# EAGLE design 620000200  -  GK_A_1.0 (EAGLE 7.2.0)
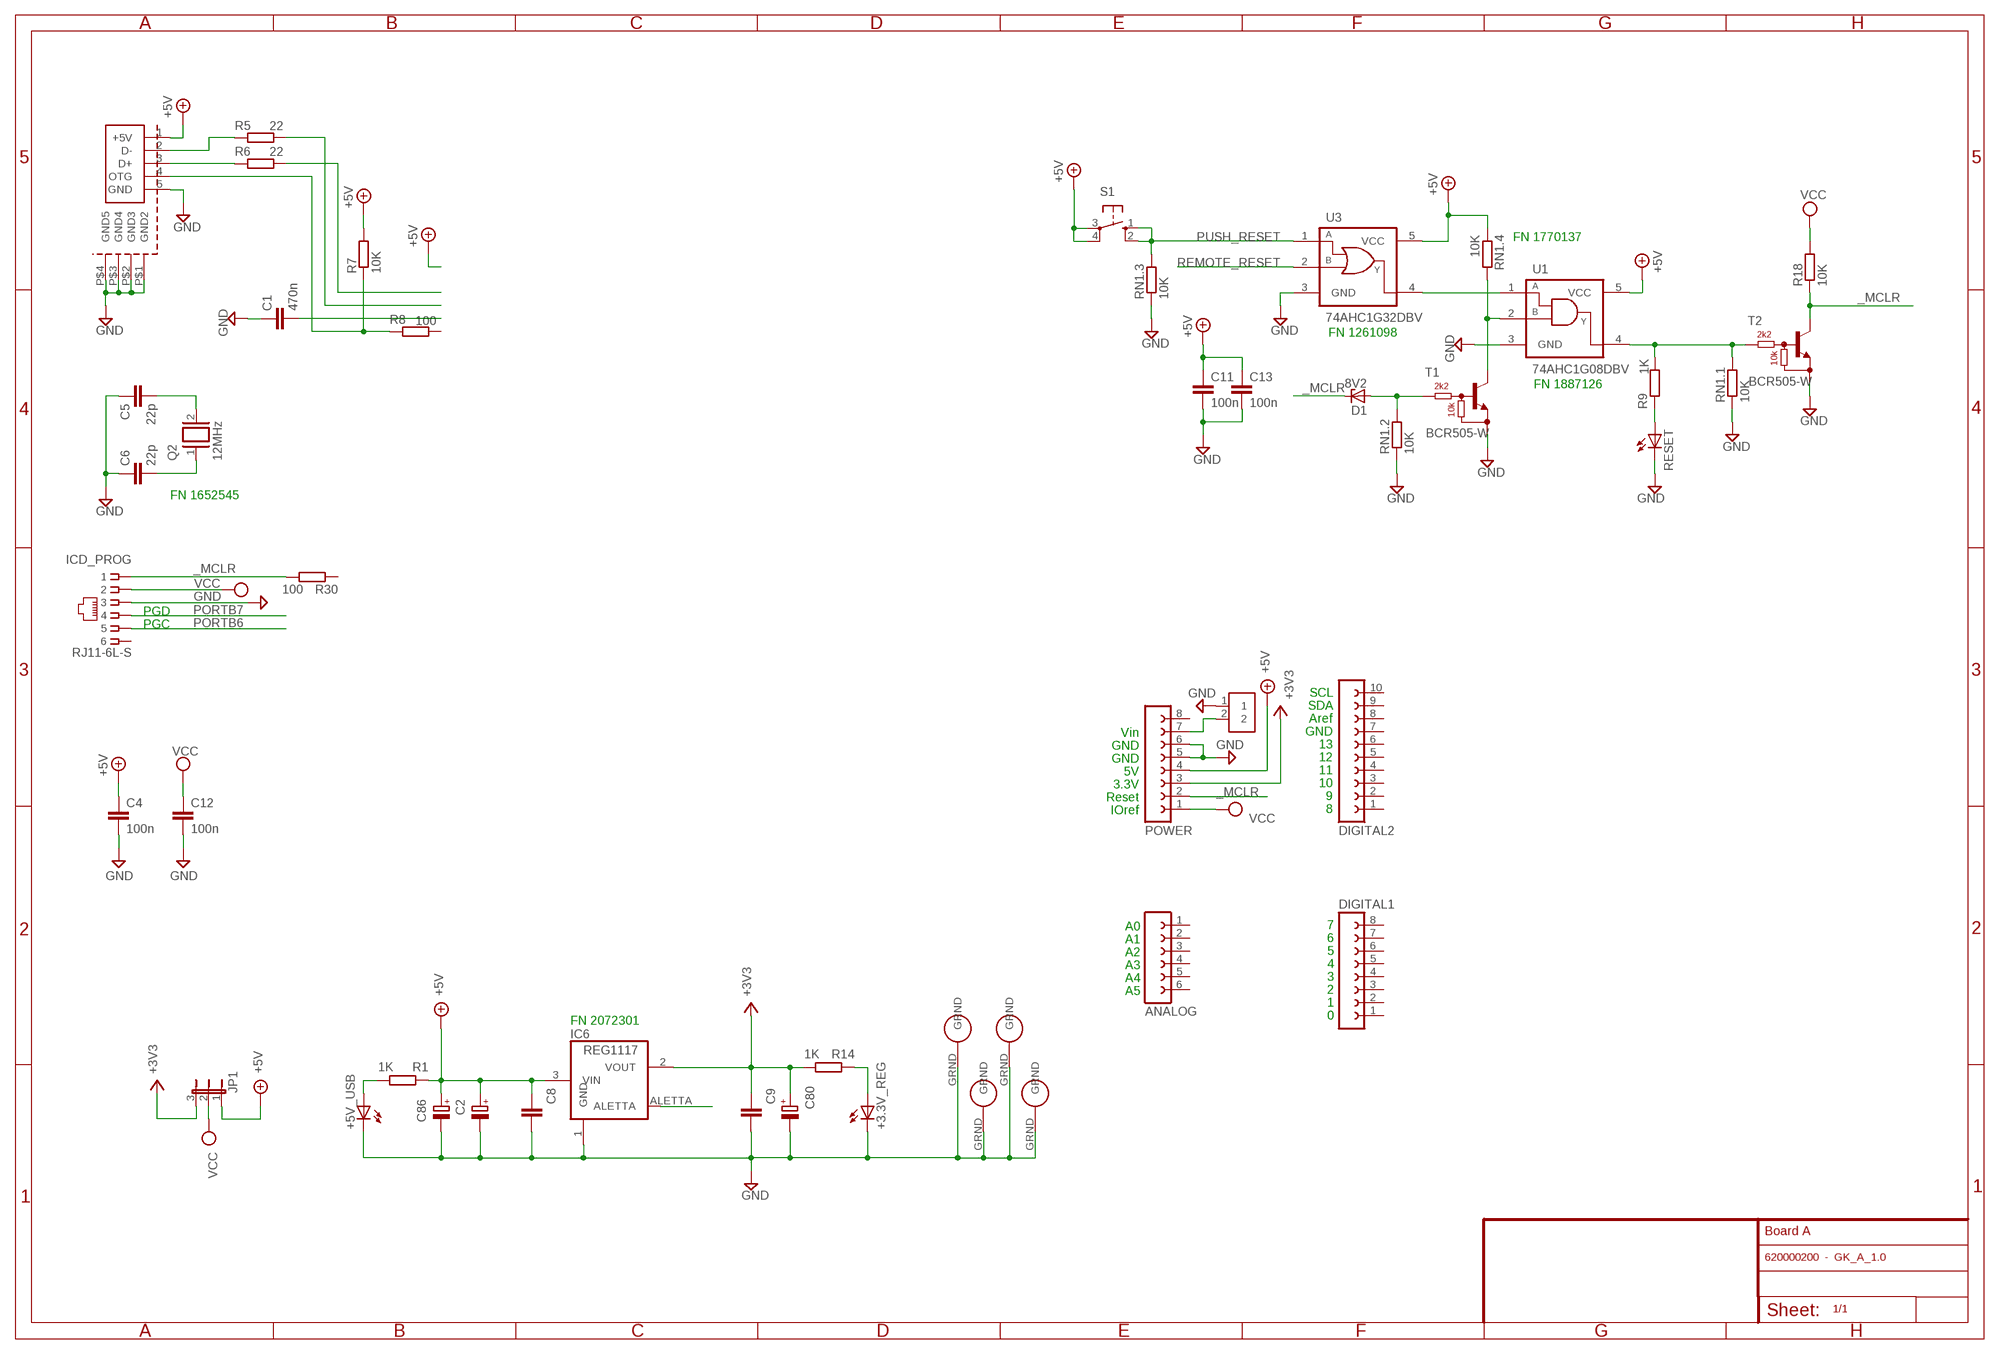
[diagram p0: schematic, sheet 1]

## Parts
+3.3V_REG  LEDCHIPLED_0805  [CHIPLED_0805]
+5V_USB  LEDCHIPLED_0805  [CHIPLED_0805]
ANALOG  FE06-1  [FE06]
C1  470n  C-EUC0805  [C0805]
C2  47u  CPOL-EU153CLV-0605  [153CLV-0605]
C4  100n  C-EUC0805  [C0805]
C5  22p  C-EUC0805  [C0805]
C6  22p  C-EUC0805  [C0805]
C8  100n  C-EUC0805K  [C0805K]
C9  100n  C-EUC0805K  [C0805K]
C11  100n  C-EUC0805  [C0805]
C12  100n  C-EUC0805  [C0805]
C13  100n  C-EUC0805  [C0805]
C80  47u  CPOL-EU153CLV-0605  [153CLV-0605]
C86  47u  CPOL-EU153CLV-0605  [153CLV-0605]
D1  8V2  ZENER-DIODESOT23  [SOT23]
DIGITAL1  FE08-1  [FE08]
DIGITAL2  FE10-1  [FE10]
IC6  REG1117  [REG1117]
ICD_PROG  RJ11-6L-S  [RJ11-NO_SHIELD]
JP1  JP2E  [JP2]
POWER  FE08-1  [FE08]
Q2  12MHz  XTAL/S  [QS]
R1  1K  R-EU_R0805W  [R0805W]
R5  22  R-EU_R0805W  [R0805W]
R6  22  R-EU_R0805W  [R0805W]
R7  10K  R-EU_R0805  [R0805]
R8  100  R-EU_R0805  [R0805]
R9  1K  R-EU_R0805  [R0805]
R14  1K  R-EU_R0805W  [R0805W]
R18  10K  R-EU_R0805  [R0805]
R30  100  R-EU_R0805W  [R0805W]
RESET  LEDCHIPLED_0805  [CHIPLED_0805]
RN1  10K  RN_EU-4  [CTS-744*083]
S1  10-XX  [B3F-10XX]
T1  BCR505-W  [SOT23-W_INFINEON]
T2  BCR505-W  [SOT23-W_INFINEON]
U1  74AHC1G08DBV  [SOT23-5]
U3  74AHC1G32DBV  [SOT23-5]
U$1  GKHOLE  [GKHOLE]
U$2  GKHOLE  [GKHOLE]
U$3  GKHOLE  [GKHOLE]
U$4  GKHOLE  [GKHOLE]
U$7  USB_SMD  [USB_MINI_SMD]
U$8  GKHEAD2  [HEAD2]

## Nets
+3V3 [+3.3V]: C9.2 C80.+ IC6.2(VOUT) JP1.3 POWER.3 R14.1
+5V [+5v]: C2.+ C4.1 C8.2 C11.1 C13.1 C86.+ IC6.3(VIN) JP1.1 POWER.4 R1.2 R7.2 RN1.4 S1.3(P) S1.4(P1) U1.5(VCC) U3.5(VCC) U$7.1(+5V)
_MCLR: D1.3(C) ICD_PROG.1 POWER.2 R18.1 R30.1 T2.3(C)
ALETTA [+3.3V]: IC6.ALETTA
GND [gnd]: +3.3V_REG.C +5V_USB.C C1.1 C2.- C4.2 C5.1 C6.1 C8.1 C9.1 C11.2 C12.2 C13.2 C80.- C86.- IC6.1(GND) ICD_PROG.3 POWER.5 POWER.6 RESET.C RN1.1 RN1.2 RN1.3 T1.2(E) T2.2(E) U1.3(GND) U3.3(GND) U$1.GRND U$2.GRND U$3.GRND U$4.GRND U$7.5(GND) U$7.P$1(GND2) U$7.P$2(GND3) U$7.P$3(GND4) U$7.P$4(GND5) U$8.1
N$2: +5V_USB.A R1.1
N$4: R9.2 RESET.A
N$6: +3.3V_REG.A R14.2
N$7: U1.1(A) U3.4(Y)
N$8: C5.2 Q2.2
N$9: R5.1
N$10: R6.1
N$11: POWER.7 U$8.2
N$12: R7.1 R8.1 U$7.4(OTG)
N$13: C6.2 Q2.1
N$14: RN1.5 T1.3(C) U1.2(B)
N$19: R9.1 RN1.8 T2.1(B) U1.4(Y)
N$20: R5.2 U$7.2(D-)
N$23: D1.1(A) RN1.7 T1.1(B)
N$26: C1.2
N$27: R6.2 U$7.3(D+)
PORTB6: ICD_PROG.5
PORTB7: ICD_PROG.4
PUSH_RESET: RN1.6 S1.1(S) S1.2(S1) U3.1(A)
REMOTE_RESET: U3.2(B)
VCC [vcc]: C12.1 ICD_PROG.2 JP1.2 POWER.1 R18.2
Unconnected: ANALOG.1 ANALOG.2 ANALOG.3 ANALOG.4 ANALOG.5 ANALOG.6 DIGITAL1.1 DIGITAL1.2 DIGITAL1.3 DIGITAL1.4 DIGITAL1.5 DIGITAL1.6 DIGITAL1.7 DIGITAL1.8 DIGITAL2.1 DIGITAL2.2 DIGITAL2.3 DIGITAL2.4 DIGITAL2.5 DIGITAL2.6 DIGITAL2.7 DIGITAL2.8 DIGITAL2.9 DIGITAL2.10 ICD_PROG.6 POWER.8 R8.2 R30.2

## Notes on the sheet
- FN 1770137
- FN 1261098
- FN 1887126
- FN 1652545
- PGD
- PGC
- SCL
- SDA
- Aref
- Vin
- GND
- GND
- 13
- GND
- 12
- 5V
- 11
- 3.3V
- 10
- Reset
- 9
- IOref
- 8
- A0
- 7
- A1
- 6
- A2
- 5
- A3
- 4
- A4
- 3
- A5
- 2
- 1
- 0
- FN 2072301
- Board A

## Library data of the parts
+3.3V_REG +5V_USB RESET = led:LED: LED OSRAM: - CHIPLED LG R971, LG N971, LY N971, LG Q971, LY Q971, LO R971, LY R971 LH N974, LH R974 LS Q976, LO Q976, LY Q976 LO Q996 - Hyper CHIPLED LW Q18S LB Q993, LB Q99A, LB R99A - SideLED LS A670, LO A670, LY A670, LG A670, LP A670 LB A673, LV A673, LT A673, LW A673 LH A674 LY A675 LS A676, LA A676, LO A676, LY A676, LW A676 LS A679, LY A679, LG A679 - Hyper Micro SIDELED® LS Y876, LA Y876, LO Y876, LY Y876 LT Y87S - SmartLED LW L88C, LW L88S LB L89C, LB L89S, LG L890 LS L89K, LO L89K, LY L89K LS L896, LA L896, LO L896, LY L896 - TOPLED LS T670, LO T670, LY T670, LG T670, LP T670 LSG T670, LSP T670, LSY T670, LOP T670, LYG T670 LG T671, LOG T671, LSG T671 LB T673, LV T673, LT T673, LW T673 LH T674 LS T676, LA T676, LO T676, LY T676, LB T676, LH T676, LSB T676, LW T676 LB T67C, LV T67C, LT T67C, LS T67K, LO T67K, LY T67K, LW E67C LS E67B, LA E67B, LO E67B, LY E67B, LB E67C, LV E67C, LT E67C LW T67C LS T679, LY T679, LG T679 LS T770, LO T770, LY T770, LG T770, LP T770 LB T773, LV T773, LT T773, LW T773 LH T774 LS E675, LA E675, LY E675, LS T675 LS T776, LA T776, LO T776, LY T776, LB T776 LHGB T686 LT T68C, LB T68C - Hyper Mini TOPLED® LB M676 - Mini TOPLED Santana® LG M470 LS M47K, LO M47K, LY M47K Source: http://www.osram.convergy.de/
ANALOG = con-lsta:FE06-1: FEMALE HEADER
C1 C4 C11-C13 = resistor:C-EU: CAPACITOR, European symbol
C2 C80 C86 = rcl:CPOL-EU: POLARIZED CAPACITOR, European symbol
C5 C6 C8 C9 = rcl:C-EU: CAPACITOR, European symbol
D1 = diode(1):ZENER-DIODE: Z-Diode
DIGITAL1 POWER = con-lsta:FE08-1: FEMALE HEADER
DIGITAL2 = con-lsta:FE10-1: FEMALE HEADER
IC6 = 029000100  -  gKEagleLibrary:REG1117
ICD_PROG = con-tycoelectronics:RJ11: CORCOM Modular RJ Jacks No Shield Source: www.tycoelectronics.com .. ENG_DS_1654001_1099_RJ_L_0507.pdf; MF: TYCO ELECTRONICS; MPN: RJ11-6L-S; OC_FARNELL: 1654827; OC_NEWARK: 50F1358
JP1 = jumper:JP2E: JUMPER
Q2 = special:XTAL/S: CRYSTAL
R1 R5-R9 R14 R18 R30 = rcl:R-EU_: RESISTOR, European symbol
RN1 = m-pad-2.1:RN_EU: Chip Resistor Array's from various manufactures
S1 = switch-omron:10-XX: OMRON SWITCH
T1 T2 = digital-transistors-1:BCR505: NPN Silicon Digital Transistor 50V 0,5A 0,33W
U1 = 74ah:74AHC1G08: SINGLE 2-INPUT POSITIVE-AND GATE
U3 = 74ah:74AHC1G32: SINGLE 2-INPUT POSITIVE-OR GATE
U$1-U$4 = gkripthw:GKHOLE
U$7 = gkripthw:USB_SMD
U$8 = 029000100  -  gKEagleLibrary:GKHEAD2

## Net classes
1 vcc: width 0.406 mm
2 gnd: width 0.406 mm
3 +5v: width 0.406 mm
4 aref: width 0.305 mm
5 +3.3V: width 0.406 mm

## Board
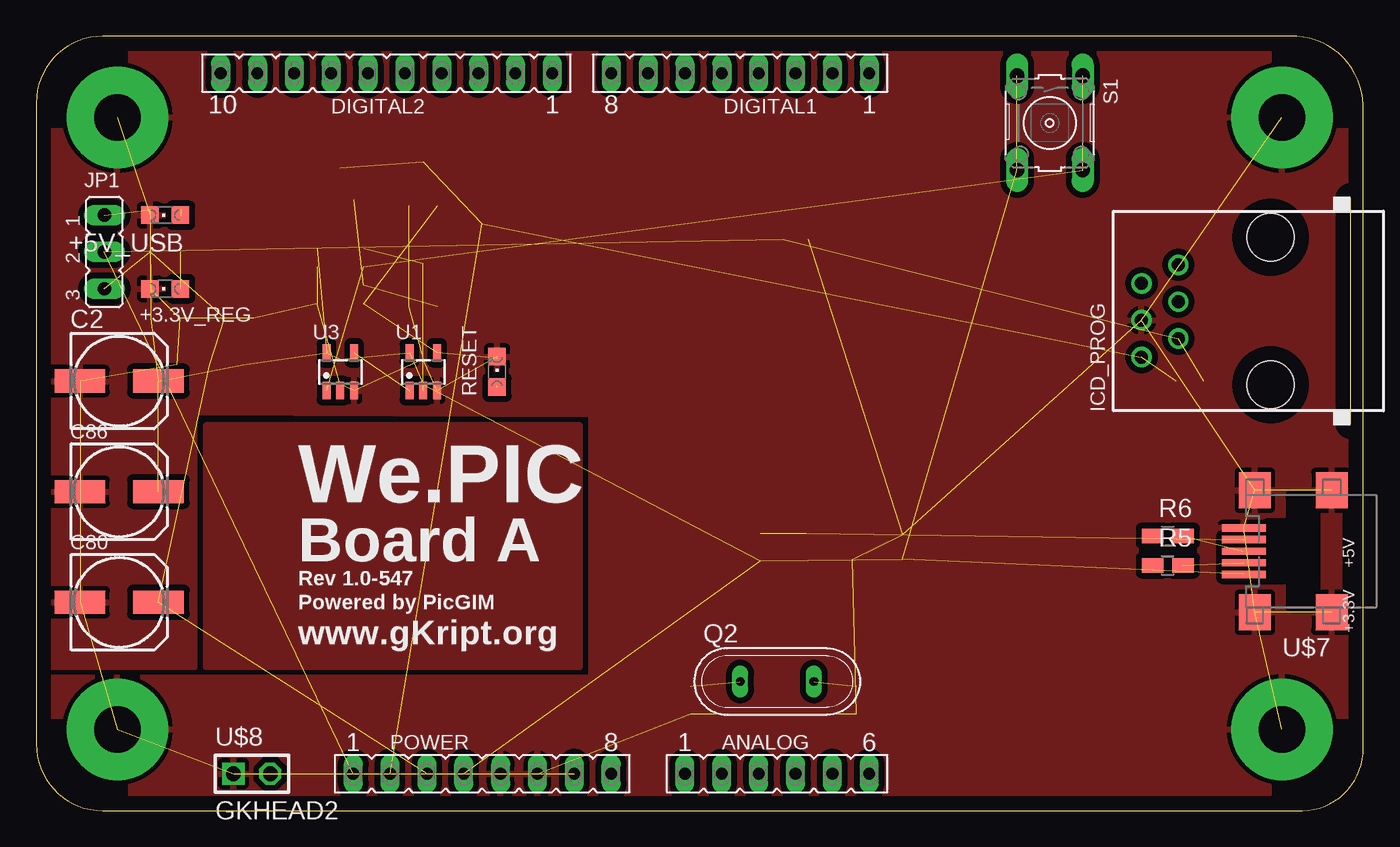
[diagram p1: board, top side]
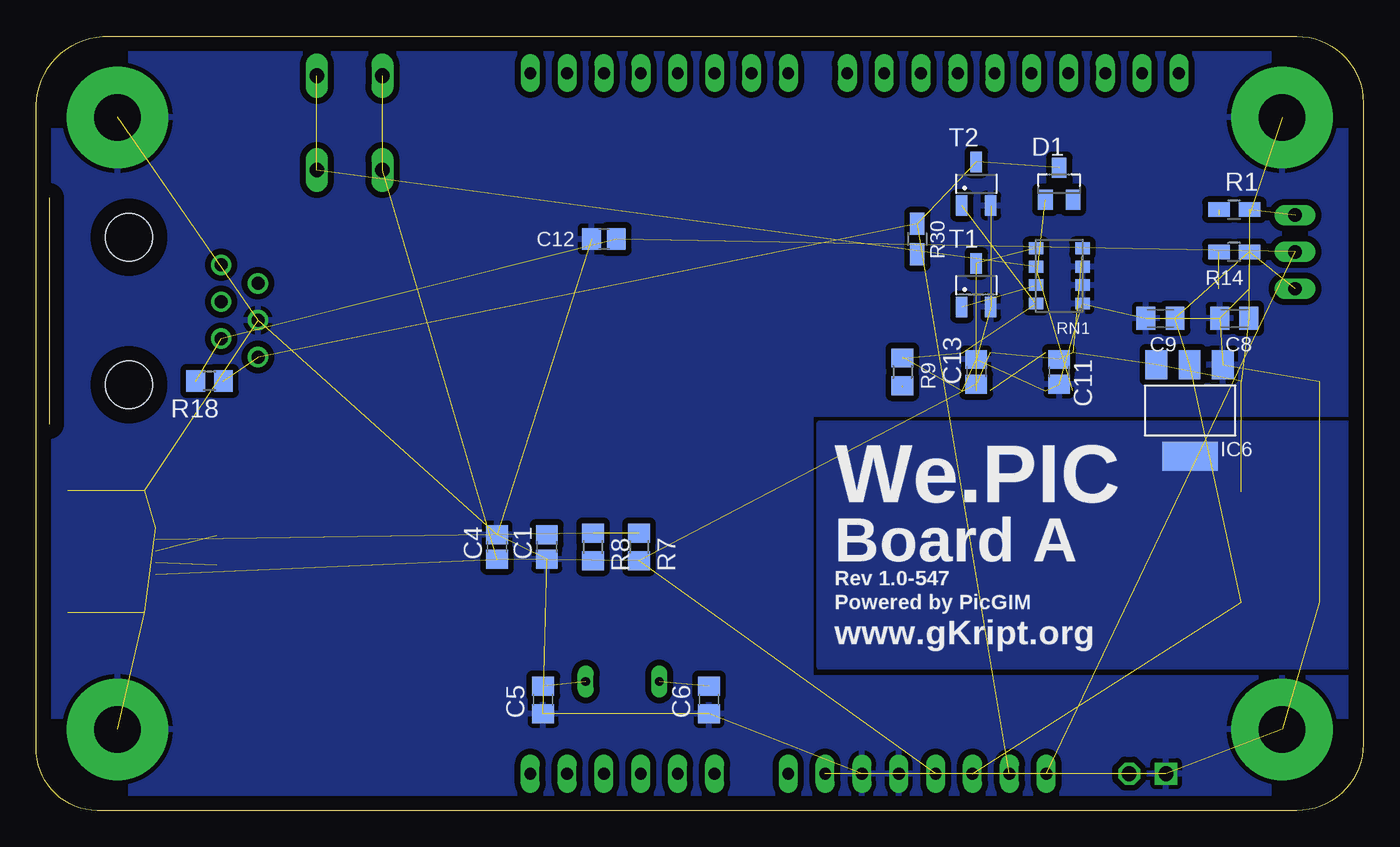
[diagram p2: board, bottom side, seen from below]

Size 91.45 x 53.35 mm. Coordinates in mm from the lower left corner, seen from the top.
Outline: 0,48.78 0,4.58 arc90 4.57,0.01 86.87,0.01 arc90 91.44,3.95 91.44,48.14 arc90 86.87,53.35 4.57,53.35 arc90 0,48.78
Copper layers (1*16): Top 0.035mm / dielectric 1.5mm / Bottom 0.035mm
Design rules "default *": minimum track width 6mil, minimum drill 24mil, track to track 8mil, track to pad 8mil, pad to pad 8mil, via to via 8mil, smd to smd 8mil, copper to edge 40mil, drill to drill 8mil, minimum pad ring 10mil, minimum via ring 8mil, stop-mask expansion 4mil, vias tented up to drill 0mil, thermal gap 12mil
tRestrict: area 0,47.6 to 5.7,53.4; area 85.7,47.6 to 91.4,53.4; area 85.7,0 to 91.4,5.7; area 0,0 to 5.7,5.7; area -2.9,9.8 to -1.9,26.7
bRestrict: area 0,47.6 to 5.7,53.4; area 85.7,47.6 to 91.4,53.4; area 85.7,0 to 91.4,5.7; area 0,0 to 5.7,5.7; area -3.2,9.8 to -0.6,26.7

### Footprints (pad centres in the part's own frame; a part is rotated, then mirrored left to right if it is on the bottom)
CHIPLED_0805 = smd 1.2 x 1.2: A 0,-1.05; C 0,1.05
FE06 = drill 0.813 long: 1 -6.35,0; 2 -3.81,0; 3 -1.27,0; 4 1.27,0; 5 3.81,0; 6 6.35,0
C0805 = smd 1.3 x 1.5: 1 -0.85,0; 2 0.85,0
153CLV-0605 = smd 3.5 x 1.6: + 2.7,0; - -2.7,0
C0805' = smd 1.3 x 1.5: 1 -0.95,0; 2 0.95,0
C0805K = smd 1.3 x 1.6: 1 -1,0; 2 1,0
SOT23 = smd 1 x 1.4: 1 -0.95,-1.1; 2 0.95,-1.1; 3 0,1.1
FE08 = drill 0.813 long: 1 -8.89,0; 2 -6.35,0; 3 -3.81,0; 4 -1.27,0; 5 1.27,0; 6 3.81,0; 7 6.35,0; 8 8.89,0
FE10 = drill 0.813 long: 1 -11.43,0; 2 -8.89,0; 3 -6.35,0; 4 -3.81,0; 5 -1.27,0; 6 1.27,0; 7 3.81,0; 8 6.35,0; 9 8.89,0; 10 11.43,0
REG1117 = smd 1.499 x 2.007: 1 -2.261,-3.15; 2 0.025,-3.15; 3 2.311,-3.15 | smd 3.81 x 2.007: ALETTA 0,3.15
RJ11-NO_SHIELD = drill 0.9 pad 1.4: 1 -3.175,8.89; 2 -1.905,6.35; 3 -0.635,8.89; 4 0.635,6.35; 5 1.905,8.89; 6 3.175,6.35 | hole 3.251: -5.08,0; 5.08,0
JP2 = drill 0.914 long: 1 -2.54,0; 2 0,0; 3 2.54,0
QS = drill 0.61 long: 1 -2.54,0; 2 2.54,0
R0805W = smd 1.5 x 1: 1 -1.052,0; 2 1.052,0
R0805 = smd 1.3 x 1.5: 1 -0.95,0; 2 0.95,0
CTS-744*083 = smd 0.8 x 1: 1 -1.905,-1.6; 2 -0.635,-1.6; 3 0.635,-1.6; 4 1.905,-1.6; 5 1.905,1.6; 6 0.635,1.6; 7 -0.635,1.6; 8 -1.905,1.6
B3F-10XX = drill 1.016 long: 1 -3.251,2.261; 2 3.251,2.261; 3 -3.251,-2.261; 4 3.251,-2.261
SOT23-W_INFINEON = smd 0.8 x 1.4: 1 -1,-1.5; 2 1,-1.5; 3 0,1.5
SOT23-5 = smd 0.55 x 1.2: 1 -0.95,-1.3; 2 0,-1.3; 3 0.95,-1.3; 4 0.95,1.3; 5 -0.95,1.3
GKHOLE = drill 3.2 pad 7: GRND 0,0
USB_MINI_SMD = smd 0.5 x 3: 1 -1.64,4.538; 2 -0.84,4.538; 3 -0.04,4.538; 4 0.76,4.538; 5 1.56,4.538 | smd 2.5 x 2.2: P$1 4.16,-1.52; P$2 4.16,3.78; P$3 -4.24,3.78; P$4 -4.24,-1.52
HEAD2 = drill 1.016 square: 1 0,0 | drill 1.016 octagon: 2 0,2.54

### Placement (x,y rotation side)
+3.3V_REG  8.89,35.95 90 top
+5V_USB  8.89,41.03 90 top
ANALOG  51.05,2.55 0 top
C1  56.26,18.17 90 bottom
C2  5.71,29.6 0 top
C4  59.69,18.17 90 bottom
C5  22p  [C0805']  56.52,7.63 90 bottom
C6  22p  [C0805']  45.09,7.63 90 bottom
C8  8.89,33.92 0 bottom
C9  13.97,33.92 0 bottom
C11  20.95,30.24 270 bottom
C12  52.32,39.38 180 bottom
C13  26.67,30.24 90 bottom
C80  5.71,14.36 0 top
C86  5.71,21.98 0 top
D1  20.95,43.19 0 bottom
DIGITAL1  48.51,50.81 180 top
DIGITAL2  24.13,50.81 180 top
IC6  11.94,27.57 180 bottom
ICD_PROG  85.06,34.43 90 top
JP1  4.7,38.49 270 top
POWER  30.73,2.55 0 top
Q2  51.05,8.9 0 top
R1  8.89,41.41 0 bottom
R5  77.98,16.9 0 top
R6  77.98,18.93 0 top
R7  49.91,18.17 270 bottom
R8  53.09,18.17 270 bottom
R9  31.75,30.24 270 bottom
R14  8.89,38.49 180 bottom
R18  79.5,29.6 180 bottom
R30  30.73,39.38 270 bottom
RESET  31.75,30.24 0 top
RN1  20.95,36.84 90 bottom
S1  69.85,47.38 270 top
T1  26.67,36.21 0 bottom
T2  26.67,43.19 0 bottom
U1  26.67,30.24 0 top
U3  20.95,30.24 0 top
U$1  85.85,5.6 0 top
U$2  85.85,47.76 0 top
U$3  5.59,5.6 0 top
U$4  5.59,47.76 0 top
U$7  87.76,17.92 90 top
U$8  13.59,2.55 270 top

### Tracks (layer width: path | path; a pad name or v marks a point on that pad's centre or on a via)
+3V3  (5 unrouted)
+5V  (16 unrouted)
_MCLR  (5 unrouted)
ALETTA
  pour Top (isolate 0.406, no thermals): 37.47,26.55 11.68,26.55 11.68,9.92 37.47,9.92
  pour Bottom (isolate 0.406, no thermals): 37.47,26.68 0,26.68 0,9.92 37.47,9.92
GND  (35 unrouted)
  pour Bottom (isolate 0.406): 92.08,53.35 -0.64,53.35 -0.64,27.32 38.1,27.32 38.1,9.16 -0.64,9.16 -0.64,0.01 92.08,0.01
  pour Top (isolate 0.406): 92.08,53.35 0,53.35 0,9.92 10.92,9.92 10.92,27.44 38.23,27.32 38.23,9.16 -0.13,9.16 0,0.01 92.08,0.01
N$2  (1 unrouted)
N$4  (1 unrouted)
N$6  (1 unrouted)
N$7  (1 unrouted)
N$8  (1 unrouted)
N$11  (1 unrouted)
N$12  (2 unrouted)
N$13  (1 unrouted)
N$14  (2 unrouted)
N$19  (3 unrouted)
N$20  (1 unrouted)
N$23  (2 unrouted)
N$27  (1 unrouted)
PUSH_RESET  (3 unrouted)
VCC  (4 unrouted)

### Text on the board
tPlace: We.PIC | Board A | Rev 1.0-547 | Powered by PicGIM | www.gKript.org
bPlace: We.PIC | Board A | Rev 1.0-547 | Powered by PicGIM | www.gKript.org
tNames: +5V | +3.3V